# EAGLE design Relay (EAGLE 6.1)
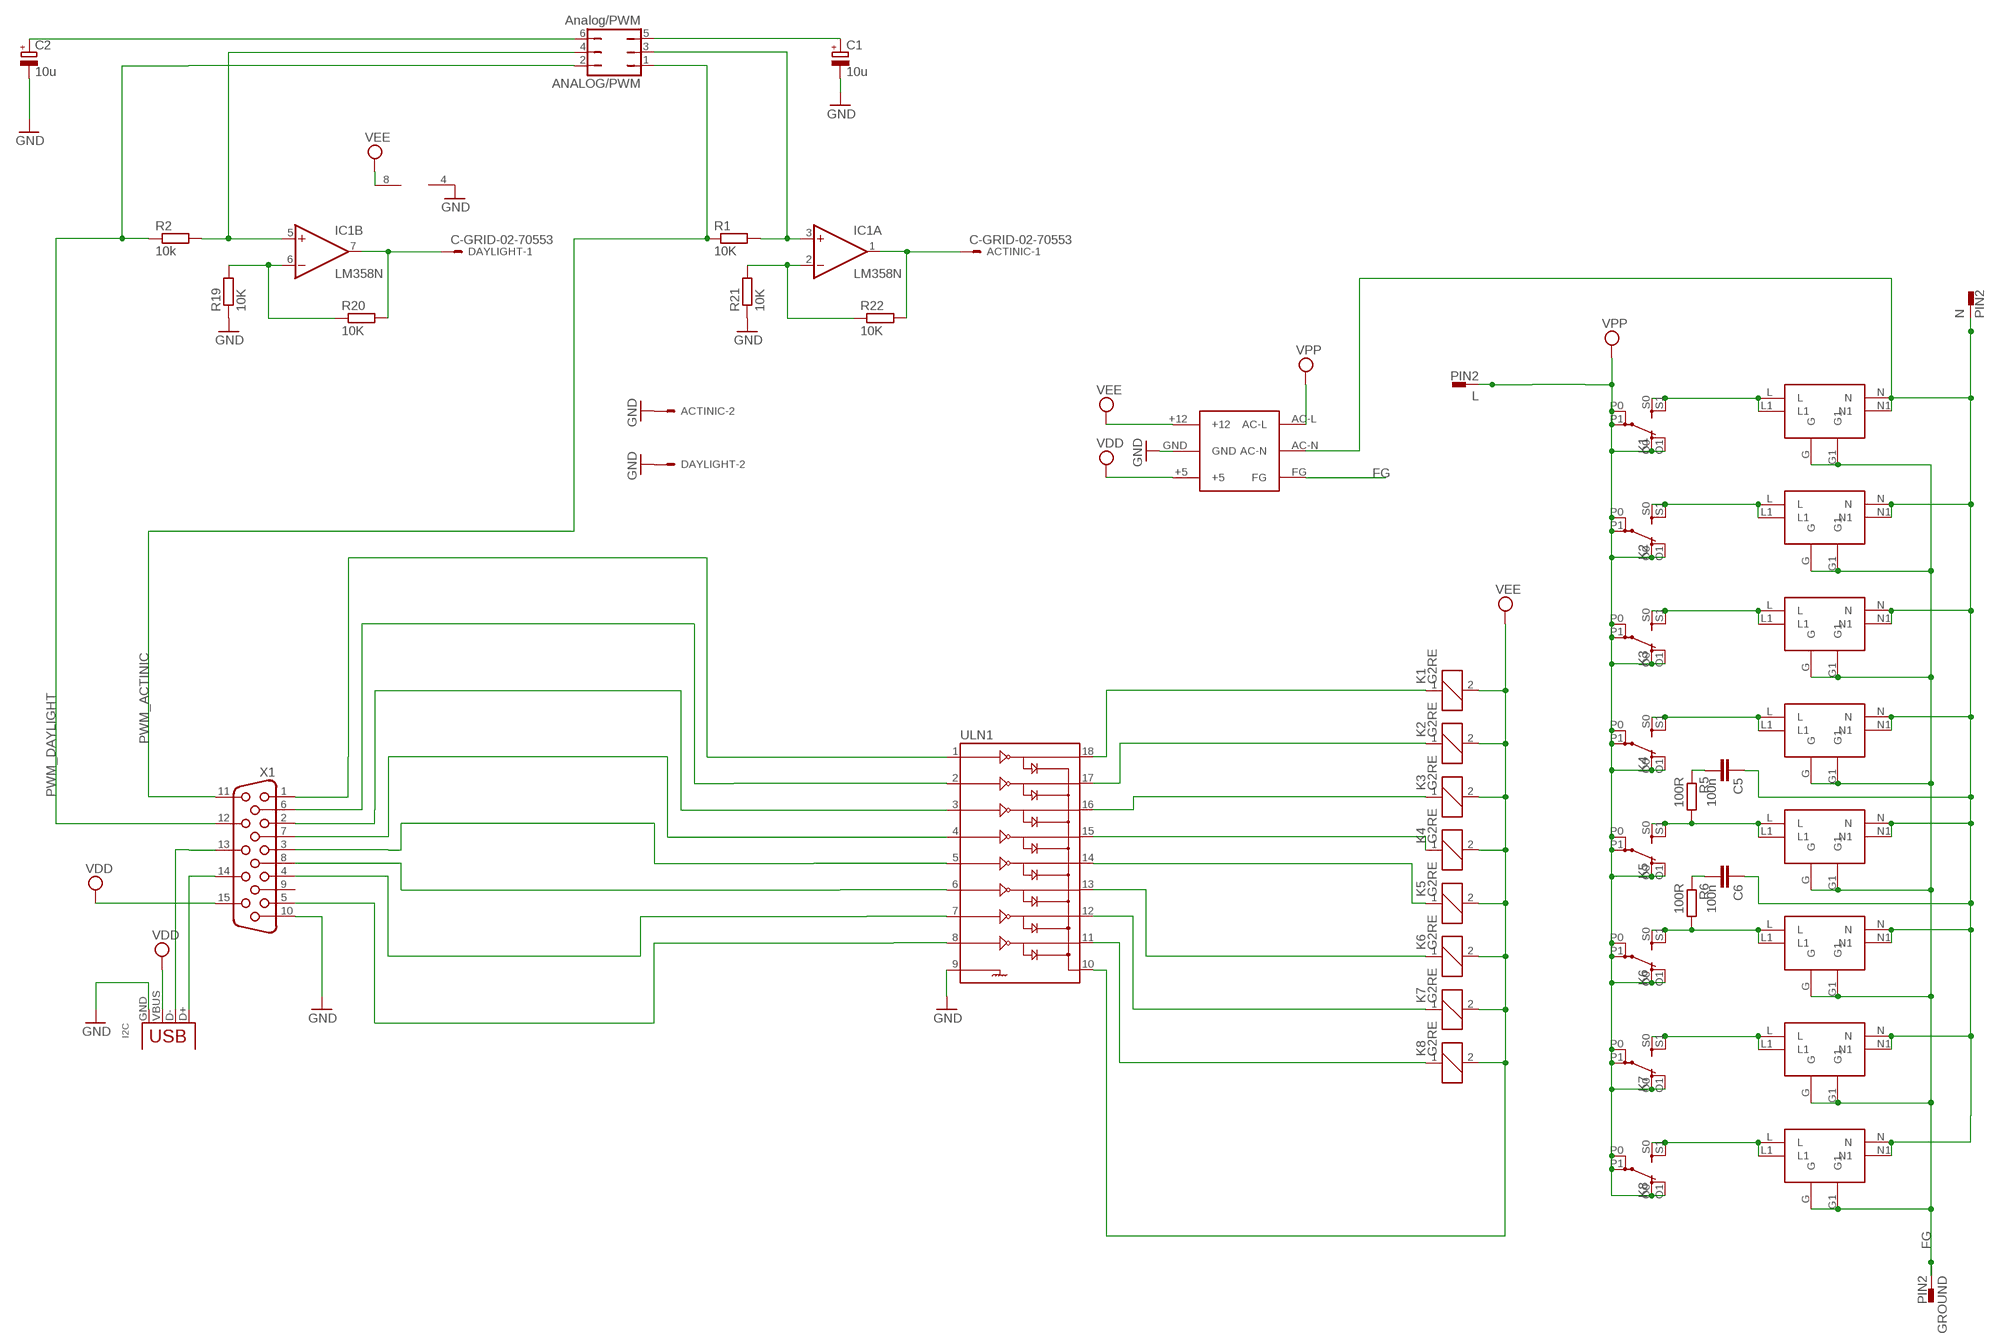
[diagram p0: schematic, sheet 1]

## Parts
ACTINIC  C-GRID-02-70553  [70553-02]
ANALOG/PWM  Analog/PWM  JP3Q  [JP3Q]
C1  10u  CPOL-EUE2-5  [E2-5]
C2  10u  CPOL-EUE2-5  [E2-5]
C5  100n  C-EU075-032X103  [C075-032X103]
C6  100n  C-EU075-032X103  [C075-032X103]
DAYLIGHT  C-GRID-02-70553  [70553-02]
GROUND  PIN2  [F061.100-INLET]
I2C  USB-A-H  [USB-A-H]
IC1  LM358N  [DIL08]
K1  G2RE  [G2RE]
K2  G2RE  [G2RE]
K3  G2RE  [G2RE]
K4  G2RE  [G2RE]
K5  G2RE  [G2RE]
K6  G2RE  [G2RE]
K7  G2RE  [G2RE]
K8  G2RE  [G2RE]
L  PIN2  [F061.100-INLET]
N  PIN2  [F061.100-INLET]
O1  SOCKET1  [SOCKET]
O2  SOCKET1  [SOCKET]
O3  SOCKET1  [SOCKET]
O4  SOCKET1  [SOCKET]
O5  SOCKET1  [SOCKET]
O6  SOCKET1  [SOCKET]
O7  SOCKET1  [SOCKET]
O8  SOCKET1  [SOCKET]
PS1  AC2200512DC  [AC2200512DC]
R1  10K  R-EU_0207/7  [0207/7]
R2  10k  R-EU_0207/7  [0207/7]
R5  100R  R-EU_0411/12  [0411/12]
R6  100R  R-EU_0411/12  [0411/12]
R19  10K  R-EU_0207/7  [0207/7]
R20  10K  R-EU_0207/7  [0207/7]
R21  10K  R-EU_0207/7  [0207/7]
R22  10K  R-EU_0207/7  [0207/7]
ULN1  ULN2803DIP  [DIL18]
X1  HF15H  [HDF15H]

## Nets
FG [LineGround]: GROUND.A1 GROUND.A2(1.1) O1.G O1.G1 O2.G O2.G1 O3.G O3.G1 O4.G O4.G1 O5.G O5.G1 O6.G O6.G1 O7.G O7.G1 O8.G O8.G1 PS1.FG
GND: ACTINIC.2 C1.- C2.- DAYLIGHT.2 I2C.GND IC1.4(P:V-) PS1.GND R19.1 R21.1 ULN1.9 X1.10
N$1 [Line]: K1.S0(2:S) K1.S1(2:S) O1.L O1.L1
N$2: ULN1.2 X1.6
N$3 [Line]: K2.S0(2:S) K2.S1(2:S) O2.L O2.L1
N$4: ULN1.4 X1.7
N$5: ULN1.5 X1.3
N$6 [Line]: K3.S0(2:S) K3.S1(2:S) O3.L O3.L1
N$7: ULN1.7 X1.4
N$8 [Line]: K4.S0(2:S) K4.S1(2:S) O4.L O4.L1
N$10: ANALOG/PWM.5 C1.+
N$11: ULN1.1 X1.1
N$12 [Line]: K5.S0(2:S) K5.S1(2:S) O5.L O5.L1 R5.2
N$13: ULN1.3 X1.2
N$14 [Line]: K6.S0(2:S) K6.S1(2:S) O6.L O6.L1 R6.2
N$15: I2C.D- X1.13
N$16 [Line]: K7.S0(2:S) K7.S1(2:S) O7.L O7.L1
N$17: ULN1.8 X1.5
N$18: K1.1 ULN1.18
N$19: K2.1 ULN1.17
N$20 [Line]: K8.S0(2:S) K8.S1(2:S) O8.L O8.L1
N$21: K3.1 ULN1.16
N$22: K4.1 ULN1.15
N$23: ANALOG/PWM.6 C2.+
N$24: K6.1 ULN1.13
N$25: K7.1 ULN1.12
N$26: K8.1 ULN1.11
N$27: ANALOG/PWM.3 IC1.3(A:+IN) R1.2
N$29: ANALOG/PWM.4 IC1.5(B:+IN) R2.2
N$30: DAYLIGHT.1 IC1.7(B:OUT) R20.2
N$31: ACTINIC.1 IC1.1(A:OUT) R22.2
N$33 [Line]: C5.2 R5.1
N$34 [Line]: C6.2 R6.1
N$43 [Line]: C5.1 C6.1 N.A1 N.A2(1.1) O1.N O1.N1 O2.N O2.N1 O3.N O3.N1 O4.N O4.N1 O5.N O5.N1 O6.N O6.N1 O7.N O7.N1 O8.N O8.N1 PS1.AC-N
N$48: ULN1.6 X1.8
N$49: I2C.D+ X1.14
N$58: K5.1 ULN1.14
N$61: IC1.6(B:-IN) R19.2 R20.1
N$62: IC1.2(A:-IN) R21.2 R22.1
PWM_ACTINIC: ANALOG/PWM.1 R1.1 X1.11
PWM_DAYLIGHT: ANALOG/PWM.2 R2.1 X1.12
VDD: I2C.VBUS PS1.+5 X1.15
VEE: IC1.8(P:V+) K1.2 K2.2 K3.2 K4.2 K5.2 K6.2 K7.2 K8.2 PS1.+12 ULN1.10
VPP [Line]: K1.O0(2:O) K1.O1(2:O) K1.P0(2:P) K1.P1(2:P) K2.O0(2:O) K2.O1(2:O) K2.P0(2:P) K2.P1(2:P) K3.O0(2:O) K3.O1(2:O) K3.P0(2:P) K3.P1(2:P) K4.O0(2:O) K4.O1(2:O) K4.P0(2:P) K4.P1(2:P) K5.O0(2:O) K5.O1(2:O) K5.P0(2:P) K5.P1(2:P) K6.O0(2:O) K6.O1(2:O) K6.P0(2:P) K6.P1(2:P) K7.O0(2:O) K7.O1(2:O) K7.P0(2:P) K7.P1(2:P) K8.O0(2:O) K8.O1(2:O) K8.P0(2:P) K8.P1(2:P) L.A1 L.A2(1.1) PS1.AC-L
Unconnected: X1.9

## Library data of the parts
ACTINIC DAYLIGHT = con-molex:C-GRID-02: CONNECTOR wire to board 2.54 mm (0.100") pitch header
ANALOG/PWM = jumper:JP3Q: JUMPER
C1 C2 = rcl:CPOL-EU: POLARIZED CAPACITOR, European symbol
C5 C6 = rcl:C-EU: CAPACITOR, European symbol
GROUND L N = con-faston:PIN2: Flachstecker Typ Tyco/Electronics/AMP TAB, FASTON Printed Circuit Board Tabs Source: http://www.buerklin.com, http://catalog.tycoelectronics.com
I2C = con-usb-3:USB: USB Connectors
IC1 = linear:LM358: OP AMP also LM158; LM258; LM2904 Source: http://cache.national.com/ds/LM/LM158.pdf
K1-K8 = relay:G2RE: RELAY 1 x switch, high current, Omron
O1-O8 = outlet:SOCKET1
PS1 = HenLv:AC2200512DC
R1 R2 R5 R6 R19-R22 = rcl:R-EU_: RESISTOR, European symbol
ULN1 = SparkFun:ULN2803: Darlington Driver ULN2803 Darlington array. 500mA max per channel, 8-channel package. Spark Fun Electronics SKU : COM-00312
X1 = con-subd:HF15: SUB-D

## Net classes
0 default: width 0.254 mm, drill 0.254 mm, clearance 0.203 mm
1 Line: width 2.286 mm, drill 0.508 mm, clearance 1.575 mm
2 LED: width 1.016 mm, drill 0.203 mm, clearance 0.254 mm
3 LineGround: width 1.778 mm, drill 0.508 mm, clearance 1.575 mm

## Board
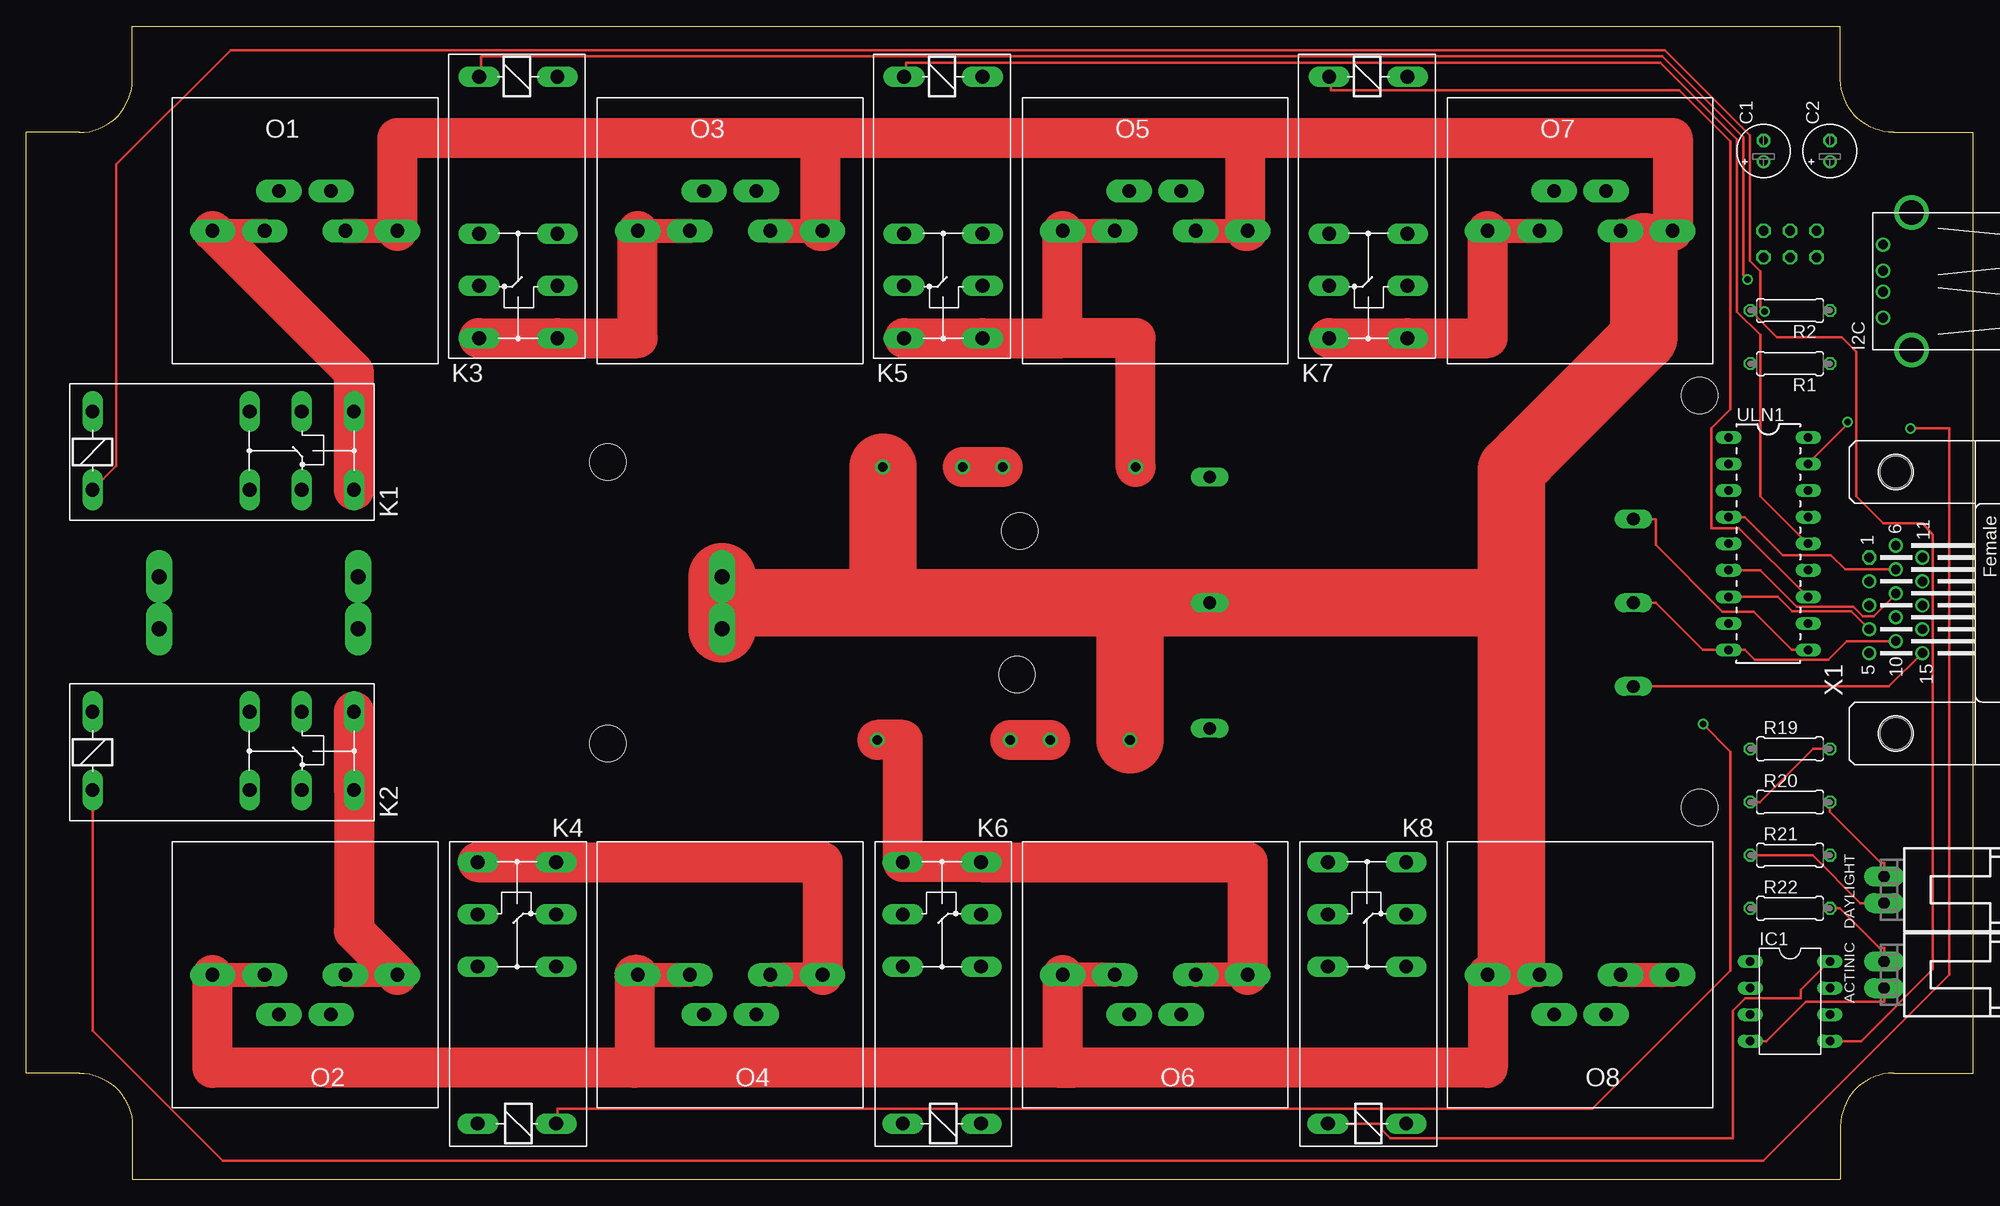
[diagram p1: board, top side]
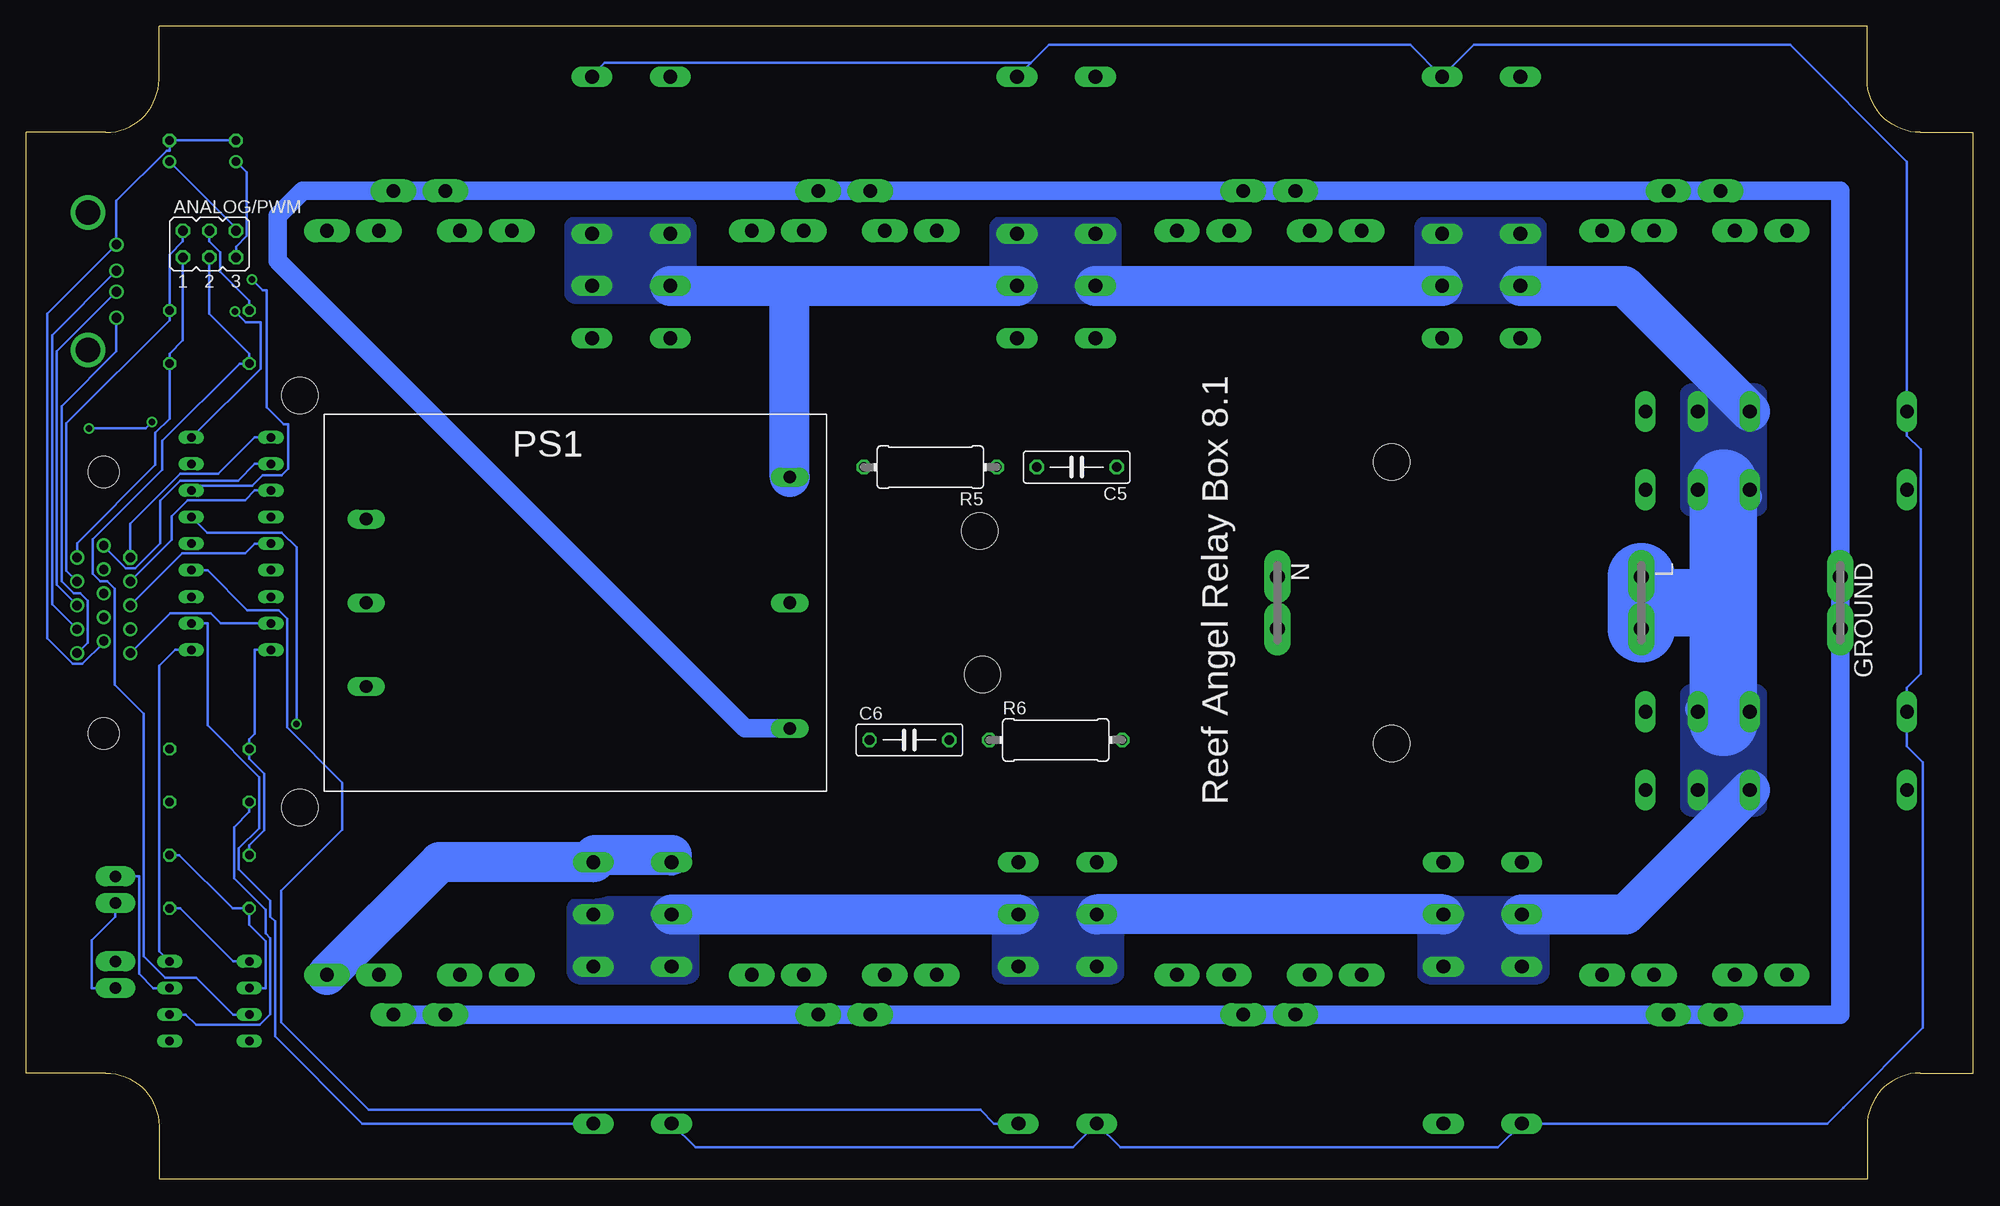
[diagram p2: board, bottom side, seen from below]

Size 186.18 x 110.24 mm. Coordinates in mm from the lower left corner, seen from the top.
Outline: 0,10.16 0,100.08 5.08,100.08 arc90 10.16,105.16 10.16,110.24 173.48,110.24 173.48,105.16 arc90 178.56,100.08 186.18,100.08 186.18,10.16 178.56,10.16 arc90 173.48,5.08 173.48,0 10.16,0 10.16,5.08 arc90 5.08,10.16 0,10.16
Copper layers (1*16): Top 0.035mm / dielectric 1.5mm / Bottom 0.035mm
Design rules: minimum track width 8mil, minimum drill 24mil, track to track 8mil, track to pad 8mil, pad to pad 8mil, via to via 8mil, smd to smd 8mil, copper to edge 40mil, drill to drill 20mil, minimum pad ring 8mil, minimum via ring 8mil, stop-mask expansion 4mil, vias tented up to drill 0mil, thermal gap 10mil
Holes 3.48 mm at 55.63,68.58 55.63,41.66 160.02,35.56 160.02,74.93 95,61.98 94.74,48.26

### Footprints (pad centres in the part's own frame; a part is rotated, then mirrored left to right if it is on the bottom)
70553-02 = drill 1.092 pad 1.93 long: 1 -1.27,-7.62; 2 1.27,-7.62
JP3Q = drill 0.914 octagon: 1 -2.54,-1.27; 2 -2.54,1.27; 3 0,-1.27; 4 0,1.27; 5 2.54,-1.27; 6 2.54,1.27
E2-5 = drill 0.813 pad 1.27: + -1.016,0 | drill 0.813 pad 1.27 octagon: - 1.016,0
C075-032X103 = drill 0.914 octagon: 1 -3.81,0; 2 3.81,0
F061.100-INLET = drill 1.433 pad 2.54 long: A1 -2.5,0; A2 2.5,0
USB-A-H = drill 0.914: D+ 2.718,-1.003; D- 2.718,1.003; GND 2.718,-3.493; VBUS 2.718,3.493 | drill 2.311: P$5 0,-6.566; P$6 0,6.566
DIL08 = drill 0.813 long: 1 -3.81,-3.81; 2 -1.27,-3.81; 3 1.27,-3.81; 4 3.81,-3.81; 5 3.81,3.81; 6 1.27,3.81; 7 -1.27,3.81; 8 -3.81,3.81
G2RE = drill 1.321 long: 1 -2.54,-3.683; 2 -2.54,3.81; O0 12.471,-3.683; O1 12.471,3.81; P0 17.45,-3.683; P1 17.45,3.81; S0 22.454,-3.683; S1 22.454,3.81
SOCKET = drill 1.3 pad 2.184 long: G -2.489,3.81; G1 2.489,3.81; L -8.839,0; L1 -3.861,0; N 3.861,0; N1 8.839,0
AC2200512DC = drill 1.2 long: +5 8,0; +12 -8,0; AC-L -12,40.5; AC-N 0,40.5; FG 12,40.5; GND 0,0
0207/7 = drill 0.813 octagon: 1 -3.81,0; 2 3.81,0
0411/12 = drill 0.914 octagon: 1 -6.35,0; 2 6.35,0
DIL18 = drill 0.813 long: 1 -10.16,-3.81; 2 -7.62,-3.81; 3 -5.08,-3.81; 4 -2.54,-3.81; 5 0,-3.81; 6 2.54,-3.81; 7 5.08,-3.81; 8 7.62,-3.81; 9 10.16,-3.81; 10 10.16,3.81; 11 7.62,3.81; 12 5.08,3.81; 13 2.54,3.81; 14 0,3.81; 15 -2.54,3.81; 16 -5.08,3.81; 17 -7.62,3.81; 18 -10.16,3.81
HDF15H = drill 0.9 octagon: 1 4.329,2.54 | drill 0.9: 2 2.043,2.54; 3 -0.243,2.54; 4 -2.529,2.54; 5 -4.815,2.54; 6 5.472,0; 7 3.186,0; 8 0.9,0; 9 -1.386,0; 10 -3.672,0; 11 4.329,-2.54; 12 2.043,-2.54; 13 -0.243,-2.54; 14 -2.529,-2.54; 15 -4.815,-2.54 | hole 3: -12.5,0; 12.5,0

### Placement (x,y rotation side)
ACTINIC  185.27,19.56 270 top
ANALOG/PWM  168.66,89.41 0 bottom
C1  166.12,98.3 90 top
C2  172.47,98.3 90 top
C5  85.73,68.08 180 bottom
C6  101.73,42 0 bottom
DAYLIGHT  185.27,27.69 270 top
GROUND  12.7,55.12 270 bottom
I2C  180.27,85.85 180 top
IC1  168.66,17.02 270 top
K1  8.89,69.6 0 top
K2  8.89,40.89 0 top
K3  46.99,102.87 270 top
K4  46.99,7.87 90 top
K5  87.63,102.87 270 top
K6  87.63,7.87 90 top
K7  128.27,102.87 270 top
K8  128.27,7.87 90 top
L  31.75,55.12 270 bottom
N  66.55,55.12 270 bottom
O1  26.67,90.68 0 top
O2  26.67,19.56 180 top
O3  67.31,90.68 0 top
O4  67.31,19.56 180 top
O5  107.95,90.68 0 top
O6  107.95,19.56 180 top
O7  148.59,90.68 0 top
O8  148.59,19.56 180 top
PS1  153.67,55.12 270 bottom
R1  168.66,77.98 180 top
R2  168.66,83.06 180 top
R5  99.73,68.08 180 bottom
R6  87.73,42 0 bottom
R19  168.66,41.15 0 top
R20  168.66,36.07 0 top
R21  168.66,30.99 0 top
R22  168.66,25.91 0 top
ULN1  166.58,60.77 270 top
X1  178.76,55.12 90 top

### Tracks (layer width: path | path; a pad name or v marks a point on that pad's centre or on a via)
FG
  Bottom 1.778: PS1.FG 117.43,43.12 162.12,87.81 162.12,92.12 159.75,94.49 O7.G1 O7.G O5.G1 O5.G O3.G1 O3.G O1.G1 O1.G 12.7,94.49 GROUND.A1 GROUND.A2 12.7,15.75 O2.G1 O2.G O4.G1 O4.G O6.G1 O6.G O8.G1 O8.G
GND
  Top 0.254: X1.10 174.1,51.45 172.31,49.66 165.27,49.66 164.32,50.61 ULN1.9 160.31,50.61 155.8,55.12 PS1.GND | ACTINIC.2 177.65,16.99 170.18,16.99 166.39,13.21 IC1.4 | DAYLIGHT.2 175.39,26.42 170.82,30.99 165.79,30.99 R21.1
  Bottom 0.254: ACTINIC.2 179.91,18.29 179.91,22.86 177.65,25.12 DAYLIGHT.2 | X1.10 178.76,51.31 180.8,49.28 181.73,49.28 184.17,51.72 184.17,82.73 I2C.GND 177.55,93.56 172.77,98.35 172.47,98.35 C2.- C1.- | ULN1.9 164.32,50.61 164.32,42.61 164.85,42.09 R19.1 164.85,40.21 163.41,38.77 163.41,33.37 164.85,31.93 R21.1
N$1
  Top 2.286: O1.L O1.L1
  Top 3.81: K1.S0 K1.S1 31.34,77.17 O1.L
N$2
  Bottom 0.254: ULN1.2 164.32,68.39 165.92,66.79 171.45,66.79 173.35,64.89 173.35,60.8 175.76,58.4 176.65,58.4 178.76,60.51 X1.6
N$3
  Top 2.286: O2.L1 O2.L
  Top 3.81: K2.S1 K2.S0 31.34,23.72 O2.L
N$4
  Top 0.254: ULN1.4 164.32,63.31 167.97,59.66 172.57,59.66 173.93,58.3 X1.7
N$5
  Bottom 0.254: X1.3 171.27,59.83 165.26,59.83 164.32,60.77 ULN1.5
N$6
  Top 2.286: O3.L O3.L1
  Top 3.81: O3.L 58.47,80.42 K3.S1 K3.S0
N$7
  Top 0.254: X1.4 174.52,54.29 168.88,54.29 167.48,55.69 164.32,55.69 ULN1.7
N$8
  Top 2.286: O4.L O4.L1
  Top 3.81: O4.L 76.15,30.33 K4.S0 K4.S1
N$10
  Bottom 0.254: ANALOG/PWM.5 166.12,89.15 165.09,90.18 165.09,96.25 C1.+
N$11
  Bottom 0.254: X1.1 176.22,62.67 171.44,67.45 167.8,67.45 164.32,70.93 ULN1.1
N$12
  Top 2.286: O5.L O5.L1
  Top 3.81: 99.11,80.42 K5.S1 K5.S0 | 99.11,80.42 O5.L | R5.2 106.08,80.42 99.11,80.42
N$13
  Bottom 0.254: ULN1.3 164.32,65.85 165.26,64.91 170.73,64.91 172.25,63.4 172.25,61.14 X1.2
N$14
  Top 2.286: O6.L O6.L1
  Top 3.81: O6.L 116.79,30.33 K6.S0 K6.S1 83.82,42 R6.2
N$15
  Bottom 0.254: X1.13 183.25,56.83 183.25,79.15 I2C.D-
N$16
  Top 2.286: O7.L O7.L1
  Top 3.81: O7.L 139.75,80.42 K7.S1 K7.S0
N$17
  Bottom 0.254: X1.5 172.4,54.12 168.55,54.12 167.57,53.15 ULN1.8
N$18  (via drill 0.61)
  Top 0.254: v166.22,82.96 165.81,83.36 165.81,86.82 164.8,87.83 164.8,99.82 156.67,107.95 24.08,107.95 19.56,107.95 8.64,97.03 8.64,68.2 K1.1
  Bottom 0.254: v166.22,82.96 165.2,81.94 163.78,81.94 163.78,77.47 170.28,70.97 ULN1.18
N$19  (via drill 0.61)
  Top 0.254: K2.1 6.35,14.22 18.8,1.78 166.12,1.78 183.9,19.56 183.9,71.58 | 183.9,71.58 183.9,71.63 | v174.14,72.39 174.14,72.19 170.49,68.53 ULN1.17 | v180.19,71.78 183.9,71.78 183.9,71.58
  Bottom 0.254: v174.14,72.39 174.75,71.78 v180.19,71.78
N$20
  Top 2.286: O8.L1 O8.L
  Bottom 2.54: K8.S1 124.46,30.99
  Bottom 3.81: O8.L 146.66,30.33 K8.S0 arc-90 131.83,30.46 131.83,30.99 124.46,30.99
N$21  (via drill 0.61)
  Top 0.254: v164.59,86 164.19,86.41 164.19,99.62 156.46,107.34 43.49,107.34 43.49,105.51 K3.1
  Bottom 0.254: v164.59,86 163.58,84.99 163.17,84.99 163.17,73.81 161.54,72.19 161.14,72.19 161.14,67.92 161.75,67.31 163.58,67.31 164.59,66.29 169.88,66.29 170.28,65.89 ULN1.16
N$22  (via drill 0.61)
  Top 0.254: v160.32,43.54 162.97,40.89 162.97,19.96 149.76,6.76 50.8,6.76 50.8,5.33 K4.1
  Bottom 0.254: v160.32,43.54 160.32,60.4 161.75,61.82 168.86,61.82 170.28,63.25 ULN1.15
N$23
  Bottom 0.254: ANALOG/PWM.6 166.12,90.93 C2.+
N$24
  Bottom 0.254: K6.1 93.62,5.33 94.95,6.66 153.44,6.66 161.78,15 161.78,27.57 155.96,33.4 155.96,37.34 | ULN1.13 168.84,58.23 165.03,54.42 162.05,54.42 161.22,53.59 161.22,43.2 155.96,37.93 | 155.96,37.34 155.96,37.93 | 155.96,37.93 155.96,37.34 | 155.96,37.93 155.96,37.34
N$25
  Top 0.254: ULN1.12 170.28,55.73 163.78,62.23 161.14,62.23 161.14,71.78 162.97,73.61 162.97,99.21 158.09,104.09 124.77,104.09 124.77,105.31 K7.1
N$26
  Bottom 0.254: K8.1 154.04,5.33 162.38,13.68 162.38,24.66 162.84,25.12 162.84,26.63 165.84,29.62 165.84,31.65 163.91,33.58 163.91,38.46 168.84,43.4 168.84,53.15 ULN1.11
N$27
  Bottom 0.254: IC1.3 166.39,15.75 169.93,19.28 172.87,19.28 174.93,21.34 174.93,44.49 177.71,47.27 177.71,56.46 178.41,57.16 179.1,57.16 179.81,57.87 179.81,61.19 173.15,67.85 173.15,70.61 165.79,77.98 R1.2 164.85,78.45 164.85,78.92 168.66,82.73 ANALOG/PWM.3
N$29
  Top 0.254: IC1.5 175.45,13.21 182.32,20.08 182.32,61.64 181.36,62.74 177.55,62.74 175.01,65.28 175.01,77.98 175.01,79.12 173.6,80.52 169.93,80.52 167.39,80.52 R2.2
  Bottom 0.254: ANALOG/PWM.4 168.66,89.66 167.62,88.62 167.62,86.77 164.85,84 R2.2
N$30
  Top 0.254: DAYLIGHT.1 177.65,30.25 177.34,30.25 172.47,35.13 R20.2
  Bottom 0.254: IC1.7 174.01,18.29 175.39,19.66 175.39,28.96 DAYLIGHT.1
N$31
  Top 0.254: ACTINIC.1 177.65,22.12 177.19,22.12 173.41,25.91 R22.2
  Bottom 0.254: IC1.1 166.39,20.83 171.48,25.91 R22.2
N$33
  Top 3.81: R5.1 C5.2
N$34
  Top 3.81: R6.1 C6.2
N$43
  Top 2.286: O2.N1 O2.N | O4.N1 O4.N | O8.N1 140.72,19.56 O8.N | O1.N O1.N1 | O3.N O3.N1 | O5.N O5.N1 | O7.N O7.N1 | O6.N O6.N1
  Top 2.54: 141.99,20.83 140.72,20.83 140.72,19.56 | O7.N1 154.69,89.15
  Top 3.81: O8.N1 139.75,10.67 100.08,10.67 | 100.08,10.67 98.81,10.67 | 98.81,10.67 58.17,10.67 | 58.17,10.67 28.96,10.67 17.83,10.67 O2.N1 | O4.N1 58.17,19.56 58.17,10.67 | O1.N1 35.51,99.57 75.95,99.57 | 75.95,99.57 116.59,99.57 | 116.59,99.57 144.53,99.57 157.43,99.57 O7.N1 | O5.N1 116.59,90.68 116.59,99.57 | O3.N1 75.95,90.68 75.95,99.57 | 99.11,10.67 100.08,10.67 | O6.N1 99.11,10.67 | 99.11,10.67 98.81,10.67
  Top 6.452: N.A1 66.55,55.12 | 66.55,55.12 N.A2 | 105.16,55.12 PS1.AC-N 141.99,55.12 | 105.16,55.12 82.3,55.12 | 82.3,55.12 66.55,55.12 | C5.1 81.92,55.12 82.3,55.12 | C6.1 105.54,55.12 105.16,55.12 | 141.99,55.12 141.99,20.83 | 154.69,89.15 154.69,80.52 143.26,69.09 141.99,67.82 141.99,55.12
N$48
  Top 0.254: X1.8 178.76,55.94 176.66,53.83 175.63,53.83 174.71,54.75 169.3,54.75 165.82,58.23 ULN1.6
N$49
  Bottom 0.254: X1.14 183.71,55 183.71,80.7 I2C.D+
N$58
  Top 0.254: ULN1.14 170.28,60.81 165.81,65.28 165.81,80.72 163.58,82.96 163.58,99.42 156.26,106.73 84.12,106.73 84.12,105.51 K5.1
N$61
  Top 0.254: R20.1 165.79,36.07 170.87,41.15 R19.2
  Bottom 0.254: IC1.6 170.92,15.75 169.94,14.77 163.86,14.77 162.84,15.79 162.84,23.06 163.3,23.51 163.3,25.79 166.29,28.79 166.29,33.68 164.85,35.13 R20.1
N$62
  Bottom 0.254: IC1.2 163.3,18.29 163.3,22.77 164.85,24.32 164.85,24.97 R22.1 166.45,25.91 171.53,30.99 R21.2
PWM_ACTINIC
  Bottom 0.254: X1.11 181.3,60.83 173.84,68.29 173.84,71.35 172.47,72.72 R1.1 172.47,78.92 171.2,80.19 ANALOG/PWM.1
PWM_DAYLIGHT
  Bottom 0.254: X1.12 182.33,58.19 182.33,72.25 172.47,82.12 R2.1 172.47,88.39 171.2,89.66 ANALOG/PWM.2
VDD
  Top 0.254: X1.15 178.12,47.12 PS1.+5
  Bottom 0.254: X1.15 180.29,51.31 180.29,55.29 181.02,56.02 181.62,56.02 182.8,57.19 182.8,73.92 177.55,79.16 I2C.VBUS
VEE
  Top 0.254: PS1.+12 155.8,63.12 155.8,60.66 162.2,54.26 165.19,54.26 168.84,50.61 ULN1.10 | K8.2 124.56,5.33 129.64,5.33 129.64,4.72 130.45,3.91 163.17,3.91 163.17,16.1 164.39,17.32 169.67,17.32 169.67,18.14 172.31,20.78 IC1.8
  Bottom 0.254: ULN1.10 171.94,50.61 173.44,49.11 173.44,21.8 IC1.8 | K8.2 122.17,3.05 117.86,3.05 86.11,3.05 K6.2 81.53,3.05 74.68,3.05 45.47,3.05 K4.2 13.97,5.33 12.45,6.86 4.83,14.48 4.83,39.88 6.35,41.4 K2.2 6.35,47.02 5.03,48.34 5.03,69.77 6.35,71.09 K1.2 6.35,97.28 17.53,108.46 47.75,108.46 K3.2 53.85,108.46 81.03,108.46 88.39,108.46 90.17,106.68 | 90.17,106.68 K5.2 | K7.2 132.08,105.51 130.86,106.73 90.22,106.73 90.17,106.68
VPP
  Bottom 2.286: 23.88,43.69 23.88,44.96 26.42,44.96 | 23.88,66.55 23.88,65.28 21.34,65.28
  Bottom 3.81: K3.P0 33.38,85.42 K1.O1 | K4.P1 33.25,25.32 K2.O0 | K4.P0 K6.P1 | K7.P0 112.78,85.42 | 112.78,85.42 K5.P1 | K8.P1 K6.P0 | K5.P0 K3.P1 | PS1.AC-L 113.17,85.03 112.78,85.42
  Bottom 6.452: 23.9,55.12 31.75,55.12 L.A2 L.A1 | 23.9,55.12 23.9,66.55 23.88,66.55 | 23.9,55.12 23.9,43.69 23.88,43.69
  pour Bottom (no thermals): 41.91,90.93 52.32,90.93 52.32,84.84 41.91,84.84
  pour Bottom (no thermals): 82.55,90.93 92.96,90.93 92.96,84.84 82.55,84.84
  pour Bottom (no thermals): 123.19,90.93 133.6,90.93 133.6,84.84 123.19,84.84
  pour Bottom (no thermals): 122.94,25.91 133.35,25.91 133.35,19.81 122.94,19.81
  pour Bottom (no thermals): 82.3,25.91 92.71,25.91 92.71,19.81 82.3,19.81
  pour Bottom (no thermals): 41.66,25.91 52.07,25.91 52.07,19.81 41.66,19.81
  pour Bottom (no thermals): 20.83,35.81 20.83,46.23 26.92,46.23 26.92,35.81
  pour Bottom (no thermals): 20.83,64.52 20.83,74.93 26.92,74.93 26.92,64.52

### Text on the board
bPlace: Reef Angel Relay Box 8.1